# Altium schematic sheet MAIN.SchDoc
size A3; DocumentNumber: 1; SheetNumber: 1; SheetTotal: 5
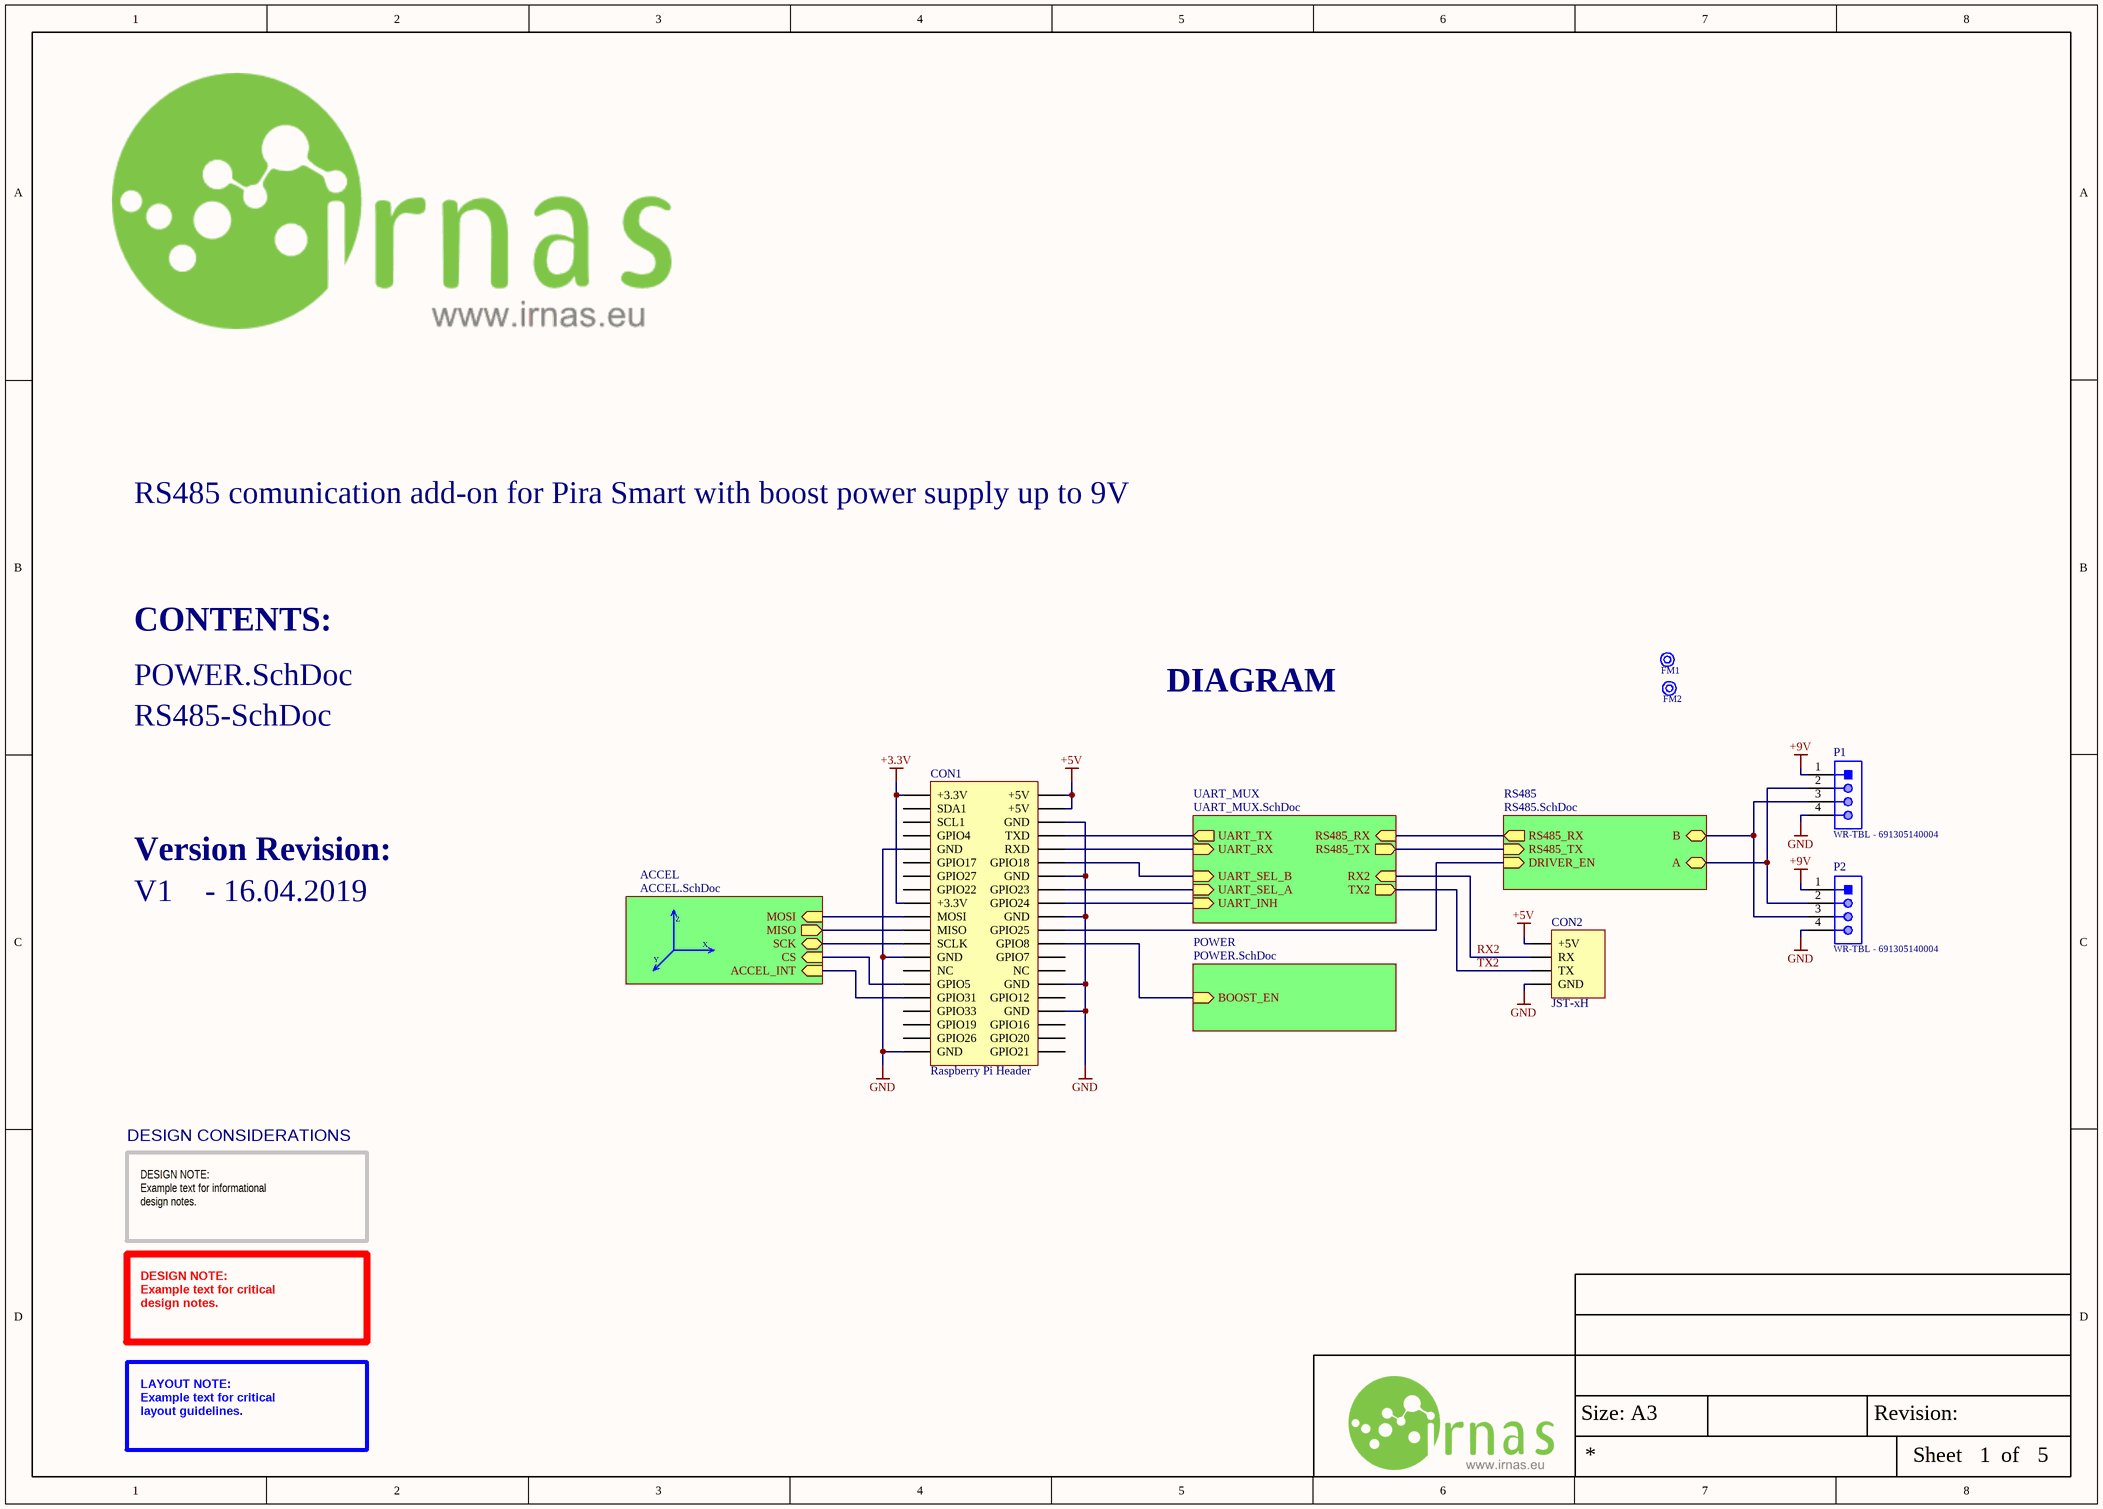
[diagram p0: MAIN.SchDoc]

## Parts
CON1  Raspberry Pi Header  [HDR2X20]
CON2  JST-xH  [JST-xH]
FM1  FIDUCAL MARKER  [FIDUCAL]  (value not drawn)
FM2  FIDUCAL MARKER  [FIDUCAL]  (value not drawn)
P1  WR-TBL - 691305140004  [691305140004]
P2  WR-TBL - 691305140004  [691305140004]

## Sub-sheets
ACCEL = ACCEL.SchDoc: CS (in), MISO (out), ACCEL_INT (in), SCK (bidir), MOSI (in)
POWER = POWER.SchDoc: BOOST_EN (in)
RS485 = RS485.SchDoc: DRIVER_EN (in), B (bidir), A (bidir), RS485_RX (out), RS485_TX (in)
UART_MUX = UART_MUX.SchDoc: UART_TX (out), UART_SEL_A (in), UART_SEL_B (in), UART_INH (in), RS485_TX (out), RX2 (in), TX2 (out), UART_RX (in), RS485_RX (in)

## Nets
+3.3V: CON1.1(+3.3V) CON1.17(+3.3V)
+5V: CON1.2(+5V) CON1.4(+5V) CON2.1(+5V)
+9V: P1.1 P2.1
GND: CON1.6(GND) CON1.9(GND) CON1.14(GND) CON1.20(GND) CON1.25(GND) CON1.30(GND) CON1.34(GND) CON1.39(GND) CON2.4(GND) P1.4 P2.4
RX2: CON2.2(RX) ; sheet UART_MUX/RX2
TX2: CON2.3(TX) ; sheet UART_MUX/TX2
NetCON1_8: CON1.8(TXD) ; sheet UART_MUX/UART_TX
NetCON1_10: CON1.10(RXD) ; sheet UART_MUX/UART_RX
NetCON1_12: CON1.12(GPIO18) ; sheet UART_MUX/UART_SEL_B
NetCON1_16: CON1.16(GPIO23) ; sheet UART_MUX/UART_SEL_A
NetCON1_18: CON1.18(GPIO24) ; sheet UART_MUX/UART_INH
NetCON1_19: CON1.19(MOSI) ; sheet ACCEL/MOSI
NetCON1_21: CON1.21(MISO) ; sheet ACCEL/MISO
NetCON1_22: CON1.22(GPIO25) ; sheet RS485/DRIVER_EN
NetCON1_23: CON1.23(SCLK) ; sheet ACCEL/SCK
NetCON1_24: CON1.24(GPIO8) ; sheet POWER/BOOST_EN
NetCON1_29: CON1.29(GPIO5) ; sheet ACCEL/CS
NetCON1_31: CON1.31(GPIO31) ; sheet ACCEL/ACCEL_INT
NetP1_2: P1.2 P2.2 ; sheet RS485/A
NetP1_3: P1.3 P2.3 ; sheet RS485/B
(unnamed): sheet RS485/RS485_RX, sheet UART_MUX/RS485_RX
(unnamed): sheet RS485/RS485_TX, sheet UART_MUX/RS485_TX

Not connected (* = marked no-connect by the designer): CON1 3(SDA1) 5(SCL1) 7(GPIO4) 11(GPIO17) 13(GPIO27) 15(GPIO22) 26(GPIO7) 27(NC) 28(NC) 32(GPIO12) 33(GPIO33) 35(GPIO19) 36(GPIO16) 37(GPIO26) 38(GPIO20) 40(GPIO21)

## Notes on the sheet
- RS485 comunication add-on for Pira Smart with boost power supply up to 9V
- CONTENTS:
- POWER.SchDoc
- DIAGRAM
- RS485-SchDoc
- Version Revision:
- V1    - 16.04.2019
- Z
- Y
- X
- DESIGN CONSIDERATIONS
- DESIGN NOTE:
  Example text for informational
  design notes.
- DESIGN NOTE:
  Example text for critical
  design notes.
- LAYOUT NOTE:
  Example text for critical
  layout guidelines.
- Size: A3
- Revision:
- Sheet
- of

## Library data of the parts
CON1 = Raspberry Pi Header: Header, 20-Pin, Dual row; LatestRevisionDate: 17-Jul-2002; LatestRevisionNote: Re-released for DXP Platform.; Publisher: Altium Limited
CON2 = B4B-XH-A(LF)(SN): 4 Positions Header, Shrouded Connector 0.098" (2.50mm) Through Hole Tin; Manufacturer: JST; No of Positions: 4; Pitch: 2.5 mm; Style/Orientation: Straight Header/Plug; Voltage Rating: 250 V; Current Rating: 3 A; No of Rows: 1; Gender: Male; Mating Type: Detent Lock; Insulation Resistance: 1000 MΩ; Supplier 1: Farnell; Manufacturer Part Number: B4B-XH-A(LF)(SN); Stock 1: 0; Termination: Crimp; Operating Temp Range: -25 to +85 °C; Contact Material: Brass; Contact Plating: Tin; Material: Polyamide; Type: Shrouded Header; Color: Natural; ComponentLink1URL: https://datasheet.ciiva.com/26894/getdatasheetpartid-455616-26894787.pdf; ComponentLink1Description: https://datasheet.ciiva.com/26894/getdatasheetpartid-455616-26894787.pdf; ComponentLink2URL: https://datasheet.ciiva.com/26924/getdatasheetpartid-640571-26924035.pdf; ComponentLink2Description: https://datasheet.ciiva.com/26924/getdatasheetpartid-640571-26924035.pdf; ComponentLink3URL: https://datasheet.ciiva.com/16203/b4b-xh-alfsn-16203642.pdf; ComponentLink3Description: https://datasheet.ciiva.com/16203/b4b-xh-alfsn-16203642.pdf; ComponentLink4URL: https://datasheet.ciiva.com/726/exh-726404.pdf; ComponentLink4Description: https://datasheet.ciiva.com/726/exh-726404.pdf; Supplier Part Number 1: 1516278
FM1 FM2 = FIDUCAL: Komp / Device: SMD; FIT: 0.94; ComponentLink1Description: Datasheet
P1 P2 = WR-TBL - 691305140004: Serie 3051 - 3.50mm Horizontal PCB Header with Plastic Latch WR-TBL, 4 pin; Pin Number: 4; Gender: Male; ComponentLink1Description: Manufacturer; ComponentLink1URL: http://www.we-online.de; ComponentLink2Description: Datasheet; ComponentLink2URL: http://katalog.we-online.de/em/datasheet/691305140004.pdf; Part Number: 691305140004; Published Date: June 2018; Publisher: Wurth Elektronik; Pitch: 3.50 mm; Operating Temperature: -40 to 105 degC; Mounting Technology: THT; Packaging: Box